# Altium schematic sheet TOP.SchDoc
size A4; SheetNumber: 1; SheetTotal: 4
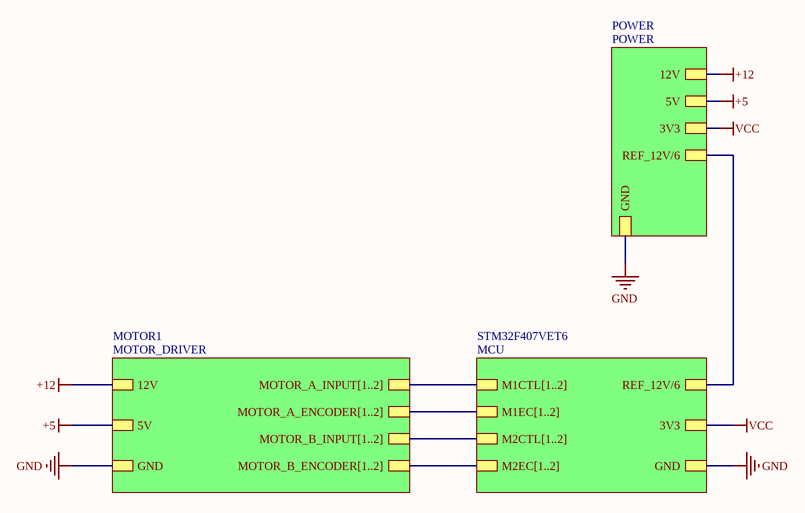
[diagram p0: TOP.SchDoc]

## Sub-sheets
MOTOR1 = MOTOR_DRIVER: 12V, GND, MOTOR_A_INPUT[1..2], MOTOR_A_ENCODER[1..2], 5V, MOTOR_B_ENCODER[1..2], MOTOR_B_INPUT[1..2]
POWER = POWER: 12V, 5V, 3V3, GND, REF_12V/6
STM32F407VET6 = MCU: 3V3, GND, M1CTL[1..2], M1EC[1..2], M2CTL[1..2], M2EC[1..2], REF_12V/6

## Nets
+5: sheet POWER/5V, sheet MOTOR1/5V
+12: sheet POWER/12V, sheet MOTOR1/12V
GND: sheet POWER/GND, sheet STM32F407VET6/GND, sheet MOTOR1/GND
VCC: sheet POWER/3V3, sheet STM32F407VET6/3V3
(unnamed): sheet POWER/REF_12V/6, sheet STM32F407VET6/REF_12V/6

## Buses and harness runs
bus sheet MOTOR1/MOTOR_A_ENCODER[1..2] = sheet STM32F407VET6/M1EC[1..2]
bus sheet MOTOR1/MOTOR_A_INPUT[1..2] = sheet STM32F407VET6/M1CTL[1..2]
bus sheet MOTOR1/MOTOR_B_ENCODER[1..2] = sheet STM32F407VET6/M2EC[1..2]
bus sheet MOTOR1/MOTOR_B_INPUT[1..2] = sheet STM32F407VET6/M2CTL[1..2]